# EAGLE design LPC1115_4TE_TOP V1.1 (EAGLE 7.6.0)
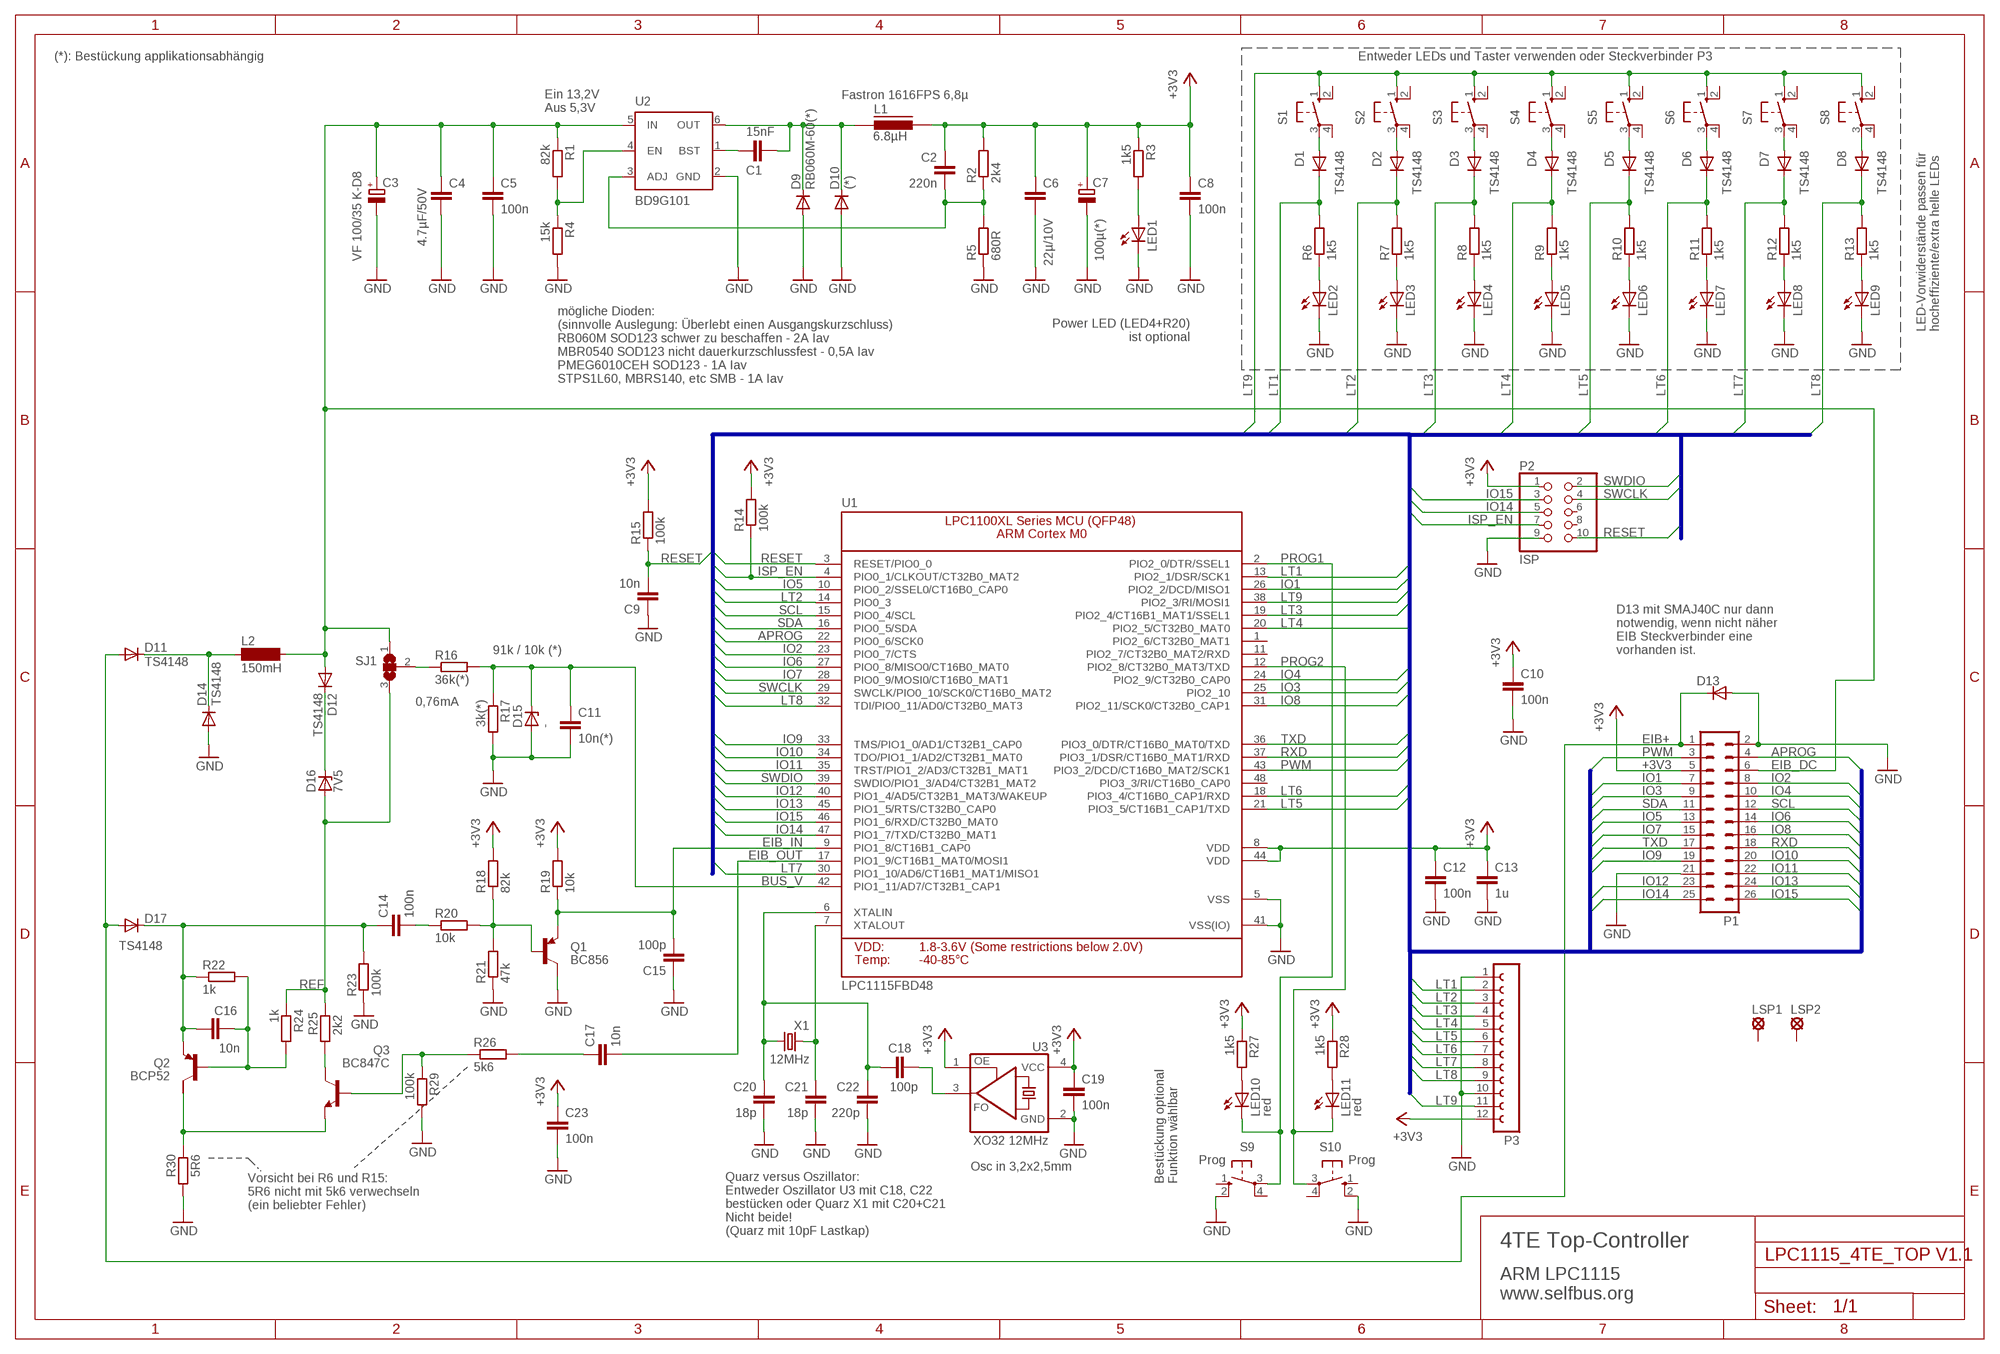
[diagram p0: schematic, sheet 1]

## Parts
C1  15nF  C-EUC0805M  [R0805M]
C2  220n  C-EUC0805M  [R0805M]
C3  VF 100/35 K-D8  CPOL-EUESMD-D  [ESMD-D]
C4  4.7µF/50V  C-EUC1206M  [R1206M]
C5  100n  C-EUC0805M  [R0805M]
C6  22µ/10V  C-EUC1210K  [C1210K]
C7  100µ(*)  CPOL-EUESMD-D  [ESMD-D]
C8  100n  C-EUC0805M  [R0805M]
C9  10n  C-EUC0805M  [R0805M]
C10  100n  C-EUC0805M  [R0805M]
C11  10n(*)  C-EUC0805M  [R0805M]
C12  100n  C-EUC0805M  [R0805M]
C13  1u  C-EUC0805M  [R0805M]
C14  100n  C-EUC0805M  [R0805M]
C15  100p  C-EUC0805M  [R0805M]
C16  10n  C-EUC0805M  [R0805M]
C17  10n  C-EUC0805M  [R0805M]
C18  100p  C-EUC0805M  [R0805M]
C19  100n  C-EUC0805M  [R0805M]
C20  18p  C-EUC0805M  [R0805M]
C21  18p  C-EUC0805M  [R0805M]
C22  220p  C-EUC0805M  [R0805M]
C23  100n  C-EUC0805M  [R0805M]
D1  TS4148  DIODE-D0805  [D0805]
D2  TS4148  DIODE-D0805  [D0805]
D3  TS4148  DIODE-D0805  [D0805]
D4  TS4148  DIODE-D0805  [D0805]
D5  TS4148  DIODE-D0805  [D0805]
D6  TS4148  DIODE-D0805  [D0805]
D7  TS4148  DIODE-D0805  [D0805]
D8  TS4148  DIODE-D0805  [D0805]
D9  RB060M-60(*)  DIODE-SOD123  [SOD123]
D10  (*)  DIODE-SMB  [SMB]
D11  TS4148  DIODE-D0805  [D0805]
D12  TS4148  DIODE-D0805  [D0805]
D13  D-SMB  [SMB]
D14  TS4148  DIODE-D0805  [D0805]
D15  -  ZENER-DIODESOT23  [SOT23]
D16  7V5  ZENER-DIODESOT23  [SOT23]
D17  TS4148  DIODE-D0805  [D0805]
L1  6.8µH  IND_FASTRON_1616FPSB  [1616FPS]
L2  150mH  SD12BS11_LIEGEND  [BS11_LIEGEND]
LED1  LEDSMT1206  [1206]
LED2  LEDSMT1206  [1206]
LED3  LEDSMT1206  [1206]
LED4  LEDSMT1206  [1206]
LED5  LEDSMT1206  [1206]
LED6  LEDSMT1206  [1206]
LED7  LEDSMT1206  [1206]
LED8  LEDSMT1206  [1206]
LED9  LEDSMT1206  [1206]
LED10  red  LEDSMT1206  [1206]
LED11  red  LEDSMT1206  [1206]
LSP1  SE13_SM  [SE13_SM]
LSP2  SE13_SM  [SE13_SM]
P1  ML26  [ML26]
P2  ISP  PINHD-2X05_2.00  [2X05M]
P3  FE12-1  [FE12]
Q1  BC856  BC856BSMD  [SOT23-BEC]
Q2  BCP52  FZT753SMD  [SOT223]
Q3  BC847C  BC847  [SOT23]
R1  82k  R-EU_R0805M  [R0805M]
R2  2k4  R-EU_R0805M  [R0805M]
R3  1k5  R-EU_R0805M  [R0805M]
R4  15k  R-EU_R0805M  [R0805M]
R5  680R  R-EU_R0805M  [R0805M]
R6  1k5  R-EU_R0805M  [R0805M]
R7  1k5  R-EU_R0805M  [R0805M]
R8  1k5  R-EU_R0805M  [R0805M]
R9  1k5  R-EU_R0805M  [R0805M]
R10  1k5  R-EU_R0805M  [R0805M]
R11  1k5  R-EU_R0805M  [R0805M]
R12  1k5  R-EU_R0805M  [R0805M]
R13  1k5  R-EU_R0805M  [R0805M]
R14  100k  R-EU_R0805M  [R0805M]
R15  100k  R-EU_R0805M  [R0805M]
R16  36k(*)  R-EU_R0805M  [R0805M]
R17  3k(*)  R-EU_R0805M  [R0805M]
R18  82k  R-EU_R0805M  [R0805M]
R19  10k  R-EU_R0805M  [R0805M]
R20  10k  R-EU_R0805M  [R0805M]
R21  47k  R-EU_R0805M  [R0805M]
R22  1k  R-EU_R0805M  [R0805M]
R23  100k  R-EU_R0805M  [R0805M]
R24  1k  R-EU_R0805M  [R0805M]
R25  2k2  R-EU_R0805M  [R0805M]
R26  5k6  R-EU_R0805M  [R0805M]
R27  1k5  R-EU_R0805M  [R0805M]
R28  1k5  R-EU_R0805M  [R0805M]
R29  100k  R-EU_R0805M  [R0805M]
R30  5R6  R-EU_R1206M  [R1206M]
S1  10-XXSMD  [B3F-10XX_SMD]
S2  10-XXSMD  [B3F-10XX_SMD]
S3  10-XXSMD  [B3F-10XX_SMD]
S4  10-XXSMD  [B3F-10XX_SMD]
S5  10-XXSMD  [B3F-10XX_SMD]
S6  10-XXSMD  [B3F-10XX_SMD]
S7  10-XXSMD  [B3F-10XX_SMD]
S8  10-XXSMD  [B3F-10XX_SMD]
S9  Prog  10-XXSMD  [B3F-10XX_SMD]
S10  Prog  10-XXSMD  [B3F-10XX_SMD]
SJ1  SJ2W  [SJ_2]
U1  LPC1115FBD48  LPC1113/4/5_QFP48_XLSERIES  [LQFP48]
U2  BD9G101  BD9G101GBD9G101G-SOT23-6MOD  [SOT23-6MOD]
U3  XO32 12MHz  ASFL  [ASF]
X1  12MHz  CRYSTALASF  [ASF]

## Nets
+3V3: C2.1 C6.1 C7.+ C8.1 C10.1 C12.1 C13.1 C19.1 C23.1 L1.P$2 P1.5 P2.1 P3.12 R2.2 R3.1 R14.2 R15.2 R18.2 R19.2 R27.1 R28.1 U1.8(VDD) U1.44(VDD) U3.1(OE) U3.4(VCC)
APROG: P1.4 U1.22(PIO0_6/SCK0)
BUS_V: C11.1 D15.3(C) R16.2 R17.1 U1.42(PIO1_11/AD7/CT32B1_CAP1)
DRAIN: C14.1 C16.1 D17.C Q2.3(E) R22.1 R23.2
EIB+: D11.A D13.1(C) D17.A P1.1
EIB_DC: C3.+ C4.1 C5.1 D12.A L2.2 P1.6 R1.1 SJ1.1 U2.5(IN)
EIB_IN: C15.2 Q1.E R19.1 U1.9(PIO1_8/CT16B1_CAP0)
EIB_OUT: C17.2 U1.17(PIO1_9/CT16B1_MAT0/MOSI1)
GND: C3.- C4.2 C5.2 C6.2 C7.- C8.2 C9.1 C10.2 C11.2 C12.2 C13.2 C15.1 C19.2 C20.2 C21.2 C22.2 C23.2 D9.A D10.A D13.2(A) D14.A D15.1(A) LED1.C LED2.C LED3.C LED4.C LED5.C LED6.C LED7.C LED8.C LED9.C P1.2 P1.21 P2.9 P3.1 P3.10 Q1.C R4.2 R5.1 R17.2 R21.1 R23.1 R29.2 R30.1 S9.2(S1) S10.2(S1) U1.5(VSS) U1.41(VSS(IO)) U2.2(GND) U3.2(GND)
IO1: P1.7 U1.26(PIO2_2/DCD/MISO1)
IO2: P1.8 U1.23(PIO0_7/CTS)
IO3: P1.9 U1.25(PIO2_10)
IO4: P1.10 U1.24(PIO2_9/CT32B0_CAP0)
IO5: P1.13 U1.10(PIO0_2/SSEL0/CT16B0_CAP0)
IO6: P1.14 U1.27(PIO0_8/MISO0/CT16B0_MAT0)
IO7: P1.15 U1.28(PIO0_9/MOSI0/CT16B0_MAT1)
IO8: P1.16 U1.31(PIO2_11/SCK0/CT32B0_CAP1)
IO9: P1.19 U1.33(TMS/PIO1_0/AD1/CT32B1_CAP0)
IO10: P1.20 U1.34(TDO/PIO1_1/AD2/CT32B1_MAT0)
IO11: P1.22 U1.35(TRST/PIO1_2/AD3/CT32B1_MAT1)
IO12: P1.23 U1.40(PIO1_4/AD5/CT32B1_MAT3/WAKEUP)
IO13: P1.24 U1.45(PIO1_5/RTS/CT32B0_CAP0)
IO14: P1.25 P2.5 U1.47(PIO1_7/TXD/CT32B0_MAT1)
IO15: P1.26 P2.3 U1.46(PIO1_6/RXD/CT32B0_MAT0)
ISP_EN: P2.7 R14.1 U1.4(PIO0_1/CLKOUT/CT32B0_MAT2)
LT1: D1.C P3.2 R6.2 U1.13(PIO2_1/DSR/SCK1)
LT2: D2.C P3.3 R7.2 U1.14(PIO0_3)
LT3: D3.C P3.4 R8.2 U1.19(PIO2_4/CT16B1_MAT1/SSEL1)
LT4: D4.C P3.5 R9.2 U1.20(PIO2_5/CT32B0_MAT0)
LT5: D5.C P3.6 R10.2 U1.21(PIO3_5/CT16B1_CAP1/TXD)
LT6: D6.C P3.7 R11.2 U1.18(PIO3_4/CT16B0_CAP1/RXD)
LT7: D7.C P3.8 R12.2 U1.30(PIO1_10/AD6/CT16B1_MAT1/MISO1)
LT8: D8.C P3.9 R13.2 U1.32(TDI/PIO0_11/AD0/CT32B0_MAT3)
LT9: P3.11 S1.1(S) S2.1(S) S3.1(S) S4.1(S) S5.1(S) S6.1(S) S7.1(S) S8.1(S) U1.38(PIO2_3/RI/MOSI1)
LX: C1.1 D9.C D10.C L1.P$1 U2.6(OUT)
N$1: C17.1 R26.2
N$2: C14.2 R20.1
N$3: C21.1 U1.7(XTALOUT) X1.1
N$4: LED11.A R28.2
N$5: R16.1 SJ1.2
N$6: Q3.3(C) R25.1
N$7: Q2.2(C) Q3.2(E) R30.2
N$8: D11.C D14.C L2.1
N$9: D12.C D16.3(C)
N$12: Q3.1(B) R26.1 R29.1
N$13: LED1.A R3.2
N$14: Q1.B R18.1 R20.2 R21.2
N$15: C16.2 Q2.1(B) R22.2 R24.2
N$16: C18.1 U3.3(FO)
N$17: D8.A S8.3(P)
N$19: C1.2 U2.1(BST)
N$20: R1.2 R4.1 U2.4(EN)
N$22: C18.2 C20.1 C22.1 U1.6(XTALIN) X1.3
N$23: D7.A S7.3(P)
N$24: C2.2 R2.1 R5.2 U2.3(ADJ)
N$25: LED2.A R6.1
N$28: D6.A S6.3(P)
N$29: D5.A S5.3(P)
N$30: D4.A S4.3(P)
N$31: D3.A S3.3(P)
N$32: D2.A S2.3(P)
N$33: LED3.A R7.1
N$34: D1.A S1.3(P)
N$35: LED10.A R27.2
N$48: LED4.A R8.1
N$50: LED5.A R9.1
N$51: LED6.A R10.1
N$53: LED7.A R11.1
N$55: LED8.A R12.1
N$57: LED9.A R13.1
PROG1: LED10.C S9.3(P) U1.2(PIO2_0/DTR/SSEL1)
PROG2: LED11.C S10.3(P) U1.12(PIO2_8/CT32B0_MAT3/TXD)
PWM: P1.3 U1.43(PIO3_2/DCD/CT16B0_MAT2/SCK1)
REF: D16.1(A) R24.1 R25.2 SJ1.3
RESET: C9.2 P2.10 R15.1 U1.3(RESET/PIO0_0)
RXD: P1.18 U1.37(PIO3_1/DSR/CT16B0_MAT1/RXD)
SCL: P1.12 U1.15(PIO0_4/SCL)
SDA: P1.11 U1.16(PIO0_5/SDA)
SWCLK: P2.4 U1.29(SWCLK/PIO0_10/SCK0/CT16B0_MAT2)
SWDIO: P2.2 U1.39(SWDIO/PIO1_3/AD4/CT32B1_MAT2)
TXD: P1.17 U1.36(PIO3_0/DTR/CT16B0_MAT0/TXD)
Unconnected: LSP1.MP LSP2.MP P2.6 P2.8 Q2.4(C/) S1.2(S1) S1.4(P1) S2.2(S1) S2.4(P1) S3.2(S1) S3.4(P1) S4.2(S1) S4.4(P1) S5.2(S1) S5.4(P1) S6.2(S1) S6.4(P1) S7.2(S1) S7.4(P1) S8.2(S1) S8.4(P1) S9.1(S) S9.4(P1) S10.1(S) S10.4(P1) U1.1(PIO2_6/CT32B0_MAT1) U1.11(PIO2_7/CT32B0_MAT2/RXD) U1.48(PIO3_3/RI/CT16B0_CAP0)

## Buses
IO[1..15],LT[1..9],SCL,SDA,PWM,APROG,RXD,TXD,RESET,SWCLK,SWDIO,ISP_EN

## Notes on the sheet
- (*): Bestückung applikationsabhängig | Entweder LEDs und Taster verwenden oder Steckverbinder P3
- Fastron 1616FPS 6,8µ
- Ein 13,2V
  Aus 5,3V
- Power LED (LED4+R20)
  ist optional
- LED-Vorwiderstände passen für 
  hocheffiziente/extra helle LEDs
- mögliche Dioden:
  (sinnvolle Auslegung: Überlebt einen Ausgangskurzschluss)
  RB060M SOD123 schwer zu beschaffen - 2A Iav
  MBR0540 SOD123 nicht dauerkurzschlussfest - 0,5A Iav
  PMEG6010CEH SOD123 - 1A Iav
  STPS1L60, MBRS140, etc SMB - 1A Iav
- 91k / 10k (*)
- D13 mit SMAJ40C nur dann
  notwendig, wenn nicht näher
  EIB Steckverbinder eine
  vorhanden ist.
- 0,76mA
- Osc in 3,2x2,5mm
- Bestückung optional
  Funktion wählbar
- Vorsicht bei R6 und R15:
  5R6 nicht mit 5k6 verwechseln
  (ein beliebter Fehler)
- Quarz versus Oszillator:
  Entweder Oszillator U3 mit C18, C22
  bestücken oder Quarz X1 mit C20+C21
  Nicht beide!
  (Quarz mit 10pF Lastkap)
- 4TE Top-Controller
- ARM LPC1115
  www.selfbus.org

## Library data of the parts
C1 C2 C4-C6 C8-C23 = rcl:C-EU: CAPACITOR, European symbol
C3 C7 = rcl:CPOL-EU: POLARIZED CAPACITOR, European symbol
D1-D12 D14 D17 = diode:DIODE-: DIODE
D13 = semicon-smd-ipc:D-: DIODE unfilled
D15 D16 = diode:ZENER-DIODE: Z-Diode
L1 = Stefan_selfbus:IND_FASTRON_1616FPS
L2 = inductor-neosid:SD12: INDUCTOR nominal inductance
LED1-LED11 = led:LED: LED OSRAM: - CHIPLED LG R971, LG N971, LY N971, LG Q971, LY Q971, LO R971, LY R971 LH N974, LH R974 LS Q976, LO Q976, LY Q976 LO Q996 - Hyper CHIPLED LW Q18S LB Q993, LB Q99A, LB R99A - SideLED LS A670, LO A670, LY A670, LG A670, LP A670 LB A673, LV A673, LT A673, LW A673 LH A674 LY A675 LS A676, LA A676, LO A676, LY A676, LW A676 LS A679, LY A679, LG A679 - Hyper Micro SIDELED® LS Y876, LA Y876, LO Y876, LY Y876 LT Y87S - SmartLED LW L88C, LW L88S LB L89C, LB L89S, LG L890 LS L89K, LO L89K, LY L89K LS L896, LA L896, LO L896, LY L896 - TOPLED LS T670, LO T670, LY T670, LG T670, LP T670 LSG T670, LSP T670, LSY T670, LOP T670, LYG T670 LG T671, LOG T671, LSG T671 LB T673, LV T673, LT T673, LW T673 LH T674 LS T676, LA T676, LO T676, LY T676, LB T676, LH T676, LSB T676, LW T676 LB T67C, LV T67C, LT T67C, LS T67K, LO T67K, LY T67K, LW E67C LS E67B, LA E67B, LO E67B, LY E67B, LB E67C, LV E67C, LT E67C LW T67C LS T679, LY T679, LG T679 LS T770, LO T770, LY T770, LG T770, LP T770 LB T773, LV T773, LT T773, LW T773 LH T774 LS E675, LA E675, LY E675, LS T675 LS T776, LA T776, LO T776, LY T776, LB T776 LHGB T686 LT T68C, LB T68C - Hyper Mini TOPLED® LB M676 - Mini TOPLED Santana® LG M470 LS M47K, LO M47K, LY M47K Source: http://www.osram.convergy.de - LUMILED® LXK2-PW12-R00, LXK2-PW12-S00, LXK2-PW14-U00, LXK2-PW14-V00 LXK2-PM12-R00, LXK2-PM12-S00, LXK2-PM14-U00 LXK2-PE12-Q00, LXK2-PE12-R00, LXK2-PE12-S00, LXK2-PE14-T00, LXK2-PE14-U00 LXK2-PB12-K00, LXK2-PB12-L00, LXK2-PB12-M00, LXK2-PB14-N00, LXK2-PB14-P00, LXK2-PB14-Q00 LXK2-PR12-L00, LXK2-PR12-M00, LXK2-PR14-Q00, LXK2-PR14-R00 LXK2-PD12-Q00, LXK2-PD12-R00, LXK2-PD12-S00 LXK2-PH12-R00, LXK2-PH12-S00 LXK2-PL12-P00, LXK2-PL12-Q00, LXK2-PL12-R00 Source: www.luxeon.com
LSP1 LSP2 = solpad:SE13: SOLDER PAD E1542, drill 1,3mm, distributor Buerklin, 07F815
P1 = con-harting-ml:ML26: HARTING; OC_FARNELL: unknown; OC_NEWARK: unknown
P2 = pinhead-2:PINHD-2X05: PIN HEADER
P3 = con-lsta:FE12-1: FEMALE HEADER; OC_FARNELL: unknown; OC_NEWARK: unknown
Q1 = transistor-pnp:BC856*: PNP Transistror
Q2 = transistor-pnp:FZT753SMD: PNP Transistor
Q3 = transistor:BC847: NPN TRANSISTOR
R1-R30 = rcl:R-EU_: RESISTOR, European symbol
S1-S10 = switch-omron:10-XX: OMRON SWITCH
SJ1 = jumper:SJ2W: SMD solder JUMPER
U1 = microbuilder:LPC1113/4/5_QFP48_XLSERIES: LPC1113/4/5 ARM Cortex M0 MCU (50MHz) - XL Series (FBD48/3x3) LPC1115FBD48/303: Max Frequency: 50MHz Flash: 64kB SRAM: 8kB ADC: 10-bit
U2 = Stefan_selfbus:BD9G101G
U3 = crystal:ASF*: CRYSTAL CLOCK OSCILLATORS 5.0 Vdc or 3.3 Vdc - LOW PROFILE ULTRA MINIATURE CERAMIC SURFACE MOUNT Source: http://www.abracon.com/Oscillators/asf1-L-L1.pdf
X1 = crystal:CRYSTAL: CRYSTAL

## Board
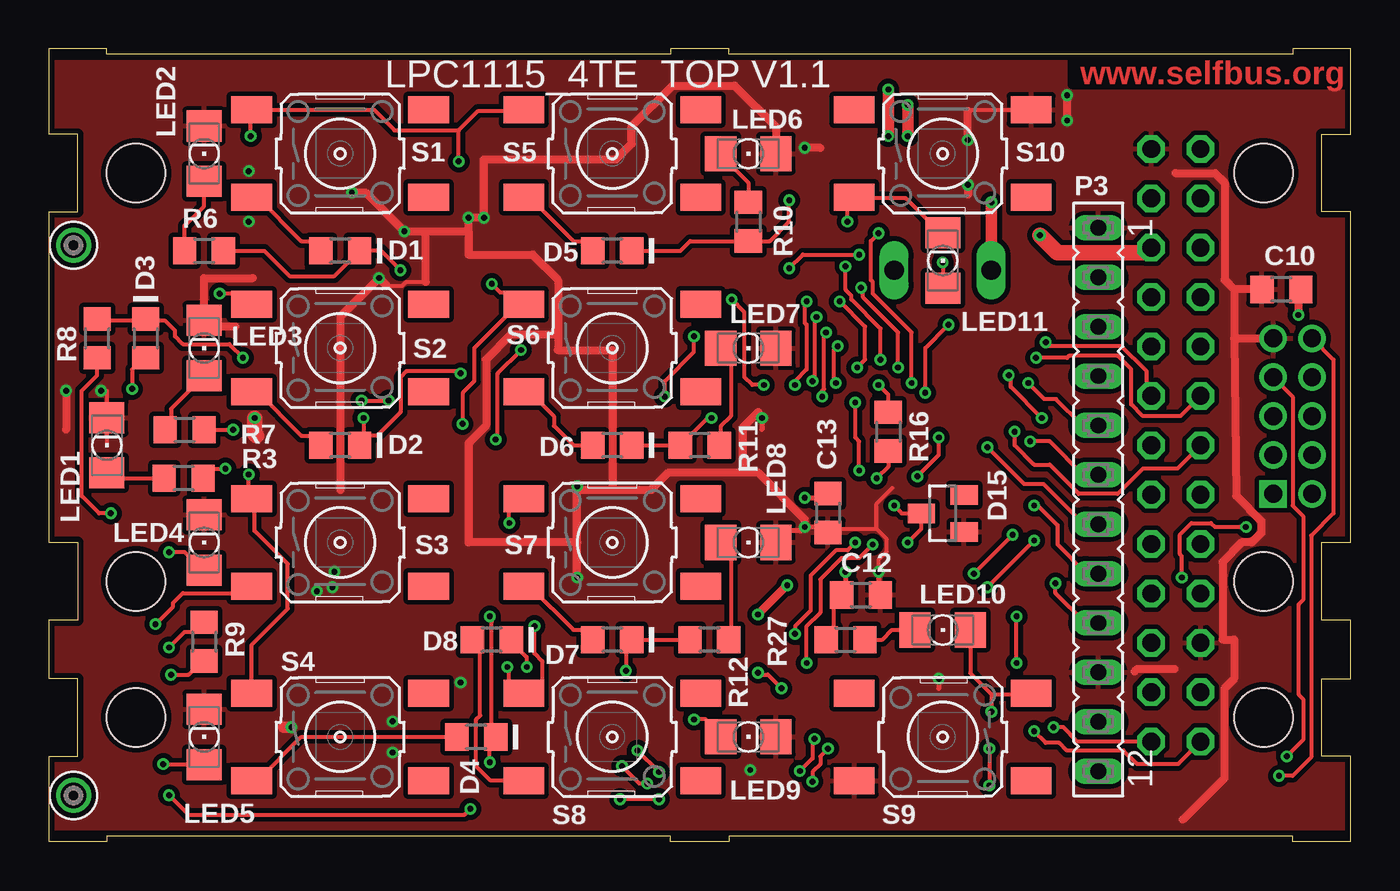
[diagram p1: board, top side]
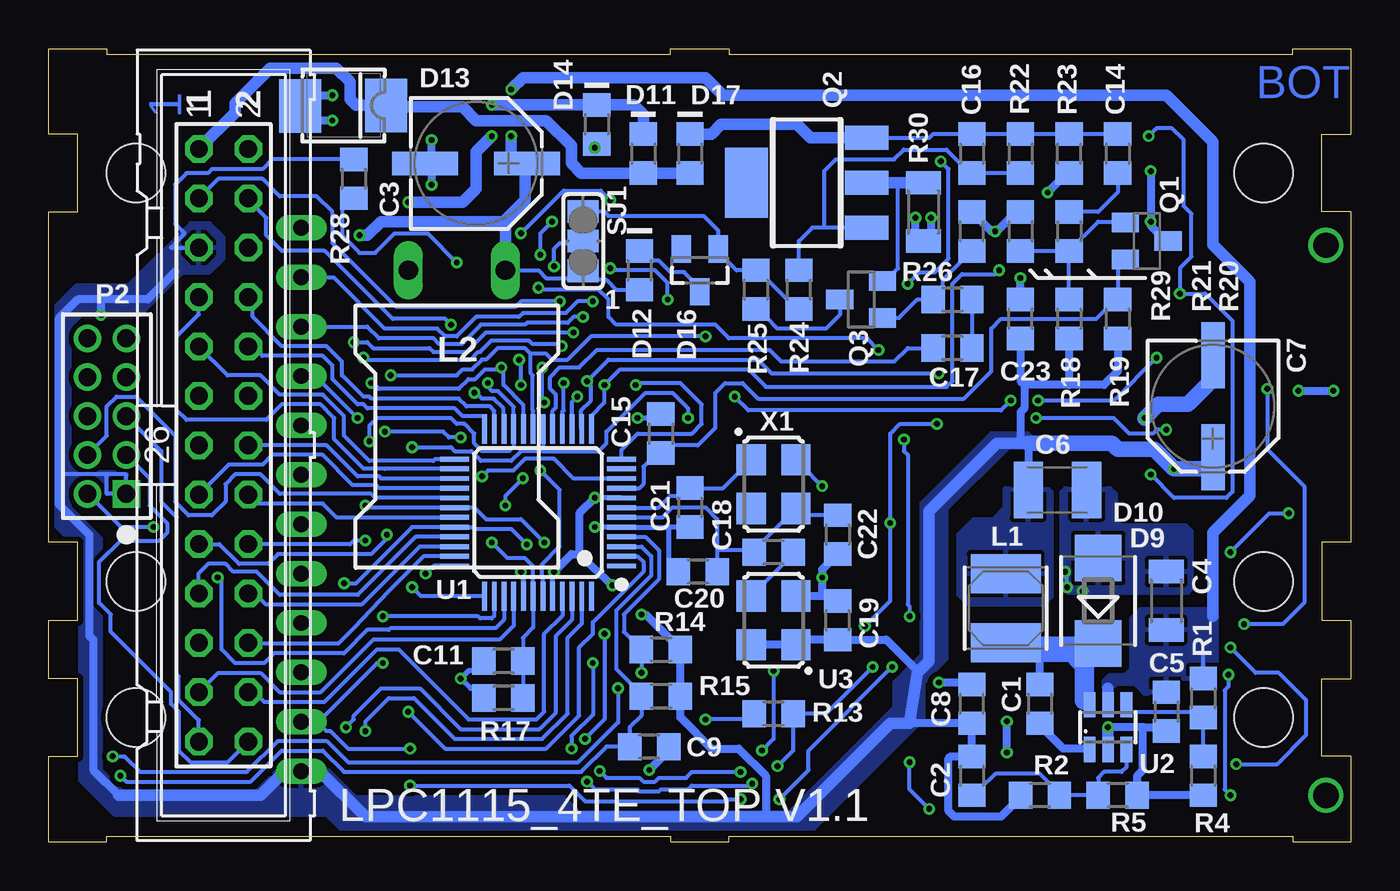
[diagram p2: board, bottom side, seen from below]

Size 67 x 40.8 mm. Coordinates in mm from the lower left corner, seen from the top.
Outline: 67,0 67,4.4 65.5,4.4 65.5,8.4 67,8.4 67,11.4 65.5,11.4 65.5,15.4 67,15.4 67,32.4 65.5,32.4 65.5,36.4 67,36.4 67,40.8 64,40.8 64,40.5 35,40.5 35,40.8 32,40.8 32,40.5 3,40.5 3,40.8 0,40.8 0,36.4 1.5,36.4 1.5,32.4 0,32.4 0,15.4 1.5,15.4 1.5,11.4 0,11.4 0,8.4 1.5,8.4 1.5,4.4 0,4.4 0,0 3,0 3,0.3 32,0.3 32,0 35,0 35,0.3 64,0.3 64,0 67,0
Copper layers (1*16): Top 0.035mm / dielectric 1.5mm / Bottom 0.035mm
Design rules "default *": minimum track width 0.18mm, minimum drill 0.3mm, track to track 0.18mm, track to pad 0.18mm, pad to pad 0.18mm, via to via 0.18mm, smd to smd 0.18mm, copper to edge 0.3mm, drill to drill 0.3mm, minimum pad ring 0.25mm, minimum via ring 0.15mm, stop-mask expansion 0.075mm, vias tented up to drill 12mil, thermal gap 0.2mm
Holes 3 mm at 62.5,6.4 4.5,6.4 4.5,34.4 62.5,34.4 4.5,13.4 62.5,13.4
bRestrict: area 23.6,16.3 to 24,16.5

### Footprints (pad centres in the part's own frame; a part is rotated, then mirrored left to right if it is on the bottom)
R0805M = smd 1.2 x 1.4: 1 -1,0; 2 1,0
ESMD-D = smd 1.2 x 3.4: + 0,2.623; - 0,-2.623
R1206M = smd 1.2 x 1.8: 1 -1.5,0; 2 1.5,0
C1210K = smd 1.5 x 2.9: 1 -1.5,0; 2 1.5,0
D0805 = smd 1.2 x 1.4: A 1,0; C -1,0
SOD123 = smd 1.4 x 1.4: A 1.9,0; C -1.9,0
SMB = smd 2.4 x 2.4: A 2.2,0; C -2.2,0
SMB' = smd 2.159 x 2.743: 1 -2.311,-0.127; 2 2.108,-0.102
SOT23 = smd 1 x 1.4: 1 -0.95,-1.1; 2 0.95,-1.1; 3 0,1.1
1616FPS = smd 3.6 x 2: P$1 0,1.775; P$2 0,-1.775
BS11_LIEGEND = drill 1 long: 1 -2.5,0; 2 2.5,0
1206 = smd 1.6 x 1.803: A -1.422,0; C 1.422,0
SE13_SM = drill 1.3: MP 0,0
ML26 = drill 0.914 octagon: 1 -15.24,-1.27; 2 -15.24,1.27; 3 -12.7,-1.27; 4 -12.7,1.27; 5 -10.16,-1.27; 6 -10.16,1.27; 7 -7.62,-1.27; 8 -7.62,1.27; 9 -5.08,-1.27; 10 -5.08,1.27; 11 -2.54,-1.27; 12 -2.54,1.27; 13 0,-1.27; 14 0,1.27; 15 2.54,-1.27; 16 2.54,1.27; 17 5.08,-1.27; 18 5.08,1.27; 19 7.62,-1.27; 20 7.62,1.27; 21 10.16,-1.27; 22 10.16,1.27; 23 12.7,-1.27; 24 12.7,1.27; 25 15.24,-1.27; 26 15.24,1.27
2X05M = drill 0.914 square: 1 -4,-1 | drill 0.914: 2 -4,1; 3 -2,-1; 4 -2,1; 5 0,-1; 6 0,1; 7 2,-1; 8 2,1; 9 4,-1; 10 4,1
FE12 = drill 0.813 long: 1 -13.97,0; 2 -11.43,0; 3 -8.89,0; 4 -6.35,0; 5 -3.81,0; 6 -1.27,0; 7 1.27,0; 8 3.81,0; 9 6.35,0; 10 8.89,0; 11 11.43,0; 12 13.97,0
SOT23-BEC = smd 1 x 1.4: B -0.95,-1.1; C 0,1.1; E 0.95,-1.1
SOT223 = smd 1.219 x 2.235: 1 -2.311,-3.099; 2 0,-3.099; 3 2.311,-3.099 | smd 3.6 x 2.2: 4 0,3.099
B3F-10XX_SMD = smd 2.1 x 1.4: 1 -4.55,2.25; 2 4.55,2.25; 3 -4.55,-2.25; 4 4.55,-2.25
SJ_2 = smd 1.168 x 1.6: 1 -1.524,0; 2 0,0; 3 1.524,0
LQFP48 = smd 1.5 x 0.25: 1 -4.3,2.75; 2 -4.3,2.25; 3 -4.3,1.75; 4 -4.3,1.25; 5 -4.3,0.75; 6 -4.3,0.25; 7 -4.3,-0.25; 8 -4.3,-0.75; 9 -4.3,-1.25; 10 -4.3,-1.75; 11 -4.3,-2.25; 12 -4.3,-2.75; 25 4.3,-2.75; 26 4.3,-2.25; 27 4.3,-1.75; 28 4.3,-1.25; 29 4.3,-0.75; 30 4.3,-0.25; 31 4.3,0.25; 32 4.3,0.75; 33 4.3,1.25; 34 4.3,1.75; 35 4.3,2.25; 36 4.3,2.75 | smd 0.25 x 1.5: 13 -2.75,-4.3; 14 -2.25,-4.3; 15 -1.75,-4.3; 16 -1.25,-4.3; 17 -0.75,-4.3; 18 -0.25,-4.3; 19 0.25,-4.3; 20 0.75,-4.3; 21 1.25,-4.3; 22 1.75,-4.3; 23 2.25,-4.3; 24 2.75,-4.3; 37 2.75,4.3; 38 2.25,4.3; 39 1.75,4.3; 40 1.25,4.3; 41 0.75,4.3; 42 0.25,4.3; 43 -0.25,4.3; 44 -0.75,4.3; 45 -1.25,4.3; 46 -1.75,4.3; 47 -2.25,4.3; 48 -2.75,4.3
SOT23-6MOD = smd 0.6 x 1.3: 1 -0.95,-1.15; 2 0,-1.15; 3 0.95,-1.15; 4 0.95,1.15; 5 0,1.15; 6 -0.95,1.15
ASF = smd 1.6 x 1.5: 1 -1.25,-1.15; 2 1.25,-1.15; 3 1.25,1.15; 4 -1.25,1.15

### Placement (x,y rotation side)
C1  16,7.1 270 bottom
C2  19.5,3.4 270 bottom
C3  45,34.9 270 bottom
C4  9.5,12.4 90 bottom
C5  9.5,6.7 270 bottom
C6  15.1,18.1 0 bottom
C7  7.1,22.4 180 bottom
C8  19.5,7.1 90 bottom
C9  36.1,4.9 180 bottom
C10  63.42,28.42 180 top
C11  43.6,9.3 180 bottom
C12  41.8,12.7 0 top
C13  40.1,16.92 270 top
C14  12,35.4 270 bottom
C15  35.5,21 270 bottom
C16  19.5,35.4 270 bottom
C17  20.5,25.4 180 bottom
C18  29.7,14.9 180 bottom
C19  26.4,11.4 90 bottom
C20  33.6,13.9 180 bottom
C21  34,17.2 270 bottom
C22  26.4,15.8 270 bottom
C23  17,26.9 90 bottom
D1  15,30.4 180 top
D2  15,20.4 180 top
D3  5,25.9 270 top
D4  22,5.4 180 top
D5  29,30.4 180 top
D6  29,20.4 180 top
D7  29,10.4 180 top
D8  22.8,10.4 180 top
D9  13,12.4 90 bottom
D10  13,12.4 90 bottom
D11  36.4,35.4 270 bottom
D12  36.6,29.4 270 bottom
D13  [SMB']  51.95,37.75 180 bottom
D14  38.8,36.9 270 bottom
D15  46,16.9 90 top
D16  33.5,29.4 180 bottom
D17  34,35.4 270 bottom
L1  17.76,12.03 180 bottom
L2  46,29.4 0 bottom
LED1  3,20.4 90 top
LED2  8,35.4 90 top
LED3  8,25.4 90 top
LED4  8,15.4 90 top
LED5  8,5.4 90 top
LED6  36,35.4 0 top
LED7  36,25.4 0 top
LED8  36,15.4 0 top
LED9  36,5.4 0 top
LED10  46,10.9 0 top
LED11  46,29.9 90 top
LSP1  1.28,30.69 0 top
LSP2  1.28,2.39 0 top
P1  58,20.4 270 bottom
P2  64,21.9 90 bottom
P3  54,17.61 270 top
Q1  10.5,30.9 270 bottom
Q2  28,33.9 90 bottom
Q3  25.2,27.9 90 bottom
R1  7.6,7.4 270 bottom
R2  16,2.4 180 bottom
R3  6.95,18.7 180 top
R4  7.6,3.4 270 bottom
R5  12,2.4 180 bottom
R6  8,30.4 0 top
R7  7,21.2 0 top
R8  2.5,25.9 90 top
R9  8,10.3 270 top
R10  36,31.9 270 top
R11  33.5,20.4 180 top
R12  34,10.4 180 top
R13  29.7,6.6 0 bottom
R14  35.5,9.9 0 bottom
R15  35.5,7.5 0 bottom
R16  43.2,21.1 270 top
R17  43.6,7.4 180 bottom
R18  14.5,26.9 270 bottom
R19  12,26.9 270 bottom
R20  14.5,31.4 270 bottom
R21  17,31.4 270 bottom
R22  17,35.4 270 bottom
R23  14.5,35.4 90 bottom
R24  28.4,28.4 90 bottom
R25  30.6,28.4 90 bottom
R26  20.5,27.9 0 bottom
R27  41,10.4 0 top
R28  51.3,34.1 270 bottom
R29  19.5,31.4 90 bottom
R30  22,32.4 90 bottom
S1  15,35.4 0 top
S2  15,25.4 0 top
S3  15,15.4 0 top
S4  15,5.4 0 top
S5  29,35.4 0 top
S6  29,25.4 0 top
S7  29,15.4 0 top
S8  29,5.4 0 top
S9  46,5.4 180 top
S10  46,35.4 0 top
SJ1  39.5,30.9 90 bottom
U1  41.82,16.94 180 bottom
U2  12.5,5.9 0 bottom
U3  29.7,11.4 90 bottom
X1  29.7,18.4 270 bottom

### Tracks (layer width: path | path; a pad name or v marks a point on that pad's centre or on a via)
+3V3  (via drill 0.3)
  Top 0.2: R27.1 40.4,10.83 40.4,12.3 C12.1 | R3.1 8.4,18.3 8.4,19.2 v9.1,19.2
  Top 0.25: v38.9,17.7 40.08,17.7 C13.1 | v41,13.9 41,12.9 C12.1
  Top 0.4: C10.1 64.3,28.42 v64.3,27.1 | v38,13.2 v36.5,11.7
  Bottom 0.2: 64,18.9 66.5,18.9 | R28.1 55.5,35.1 56,34.6 58.6,34.6 58.8,34.4 59.9,34.4 60.5,33.8 60.5,31.79 60,31.3 60.7,30.56 P1.5 | 64,18.9 64,17.9 P2.1 63,18.9 64,18.9
  Bottom 0.25: U1.8 v38.89,17.69 v38.9,17.7 | U1.44 41.07,13.83 v41,13.9
  Bottom 0.4: 14.5,23.5 16.8,23.5 | R18.2 14.5,23.5 | C23.1 17,23.7 16.8,23.5 | 16.8,23.5 16.8,22.3 17,22.1 17,20.5 | 16.6,20.5 C6.1 | 60.5,29.33 61.9,27.9 64.3,27.9 | 64.3,27.9 65.5,27.9 66.5,26.9 66.5,18.9 66.5,17.4 64.9,15.8 64.9,10.6 64.7,10.4 64.7,3.7 63.4,2.4 | v38.9,17.7 39.7,16.9 39.7,14.8 | 39.7,14.8 v38,13.2 | v41,13.9 40.1,14.8 39.7,14.8 | v64.3,27.1 64.3,27.9 | R19.2 12,24.2 12.7,23.5 14.5,23.5 | 30.1,1.3 30.1,3.4 31.5,4.8 32.9,4.8 34.5,6.4 R15.2 R14.2 36.3,11.7 v36.5,11.7 | R2.2 17,2.3 18,1.3 20.4,1.3 20.7,1.6 20.7,4.3 20.6,4.4 C2.1 C8.1 22.7,6.1 | U3.4 U3.1 28.3,10.4 C19.1 23.9,10.4 22.25,8.75
  Bottom 0.6: 54.01,3.7 53.1,3.7 50.7,1.3 30.1,1.3 28.5,1.3 23.7,6.1 22.7,6.1 22.3,8.7 22.25,8.75 21.7,9.3 21.7,17 18.2,20.5 17,20.5 16.6,20.5 | 54.81,3.69 56.1,2.4 63.4,2.4
  Bottom 0.8: 16.6,20.5 12.3,20.5 12,20.2 10.1,20.2 v9.1,19.2 7.4,19.2 7.1,19.5 C7.+
  pour Bottom: 15.4,12.6 15.8,12.2 19.7,12.2 20.2,12.7 20.2,15.8 19.4,16.6 18.4,16.6 17.8,17.2 17.8,18.2 15.6,18.2 15.4,18
  pour Bottom (isolate 0.25): 16.4,20.3 16.3,20.4 16.3,20.7 16.6,21 18.5,21 22.1,17.4 22.1,9.6 23.5,8.2 23.5,6.9 28.9,1.5 39.7,1.5 40.5,2.3 51.2,2.3 52.8,3.9 55,3.9 56.3,2.6 63.2,2.6 64.3,3.7 64.3,15.6 65.9,17.2 65.9,18.2 65.6,18.5 64.5,18.5 63.9,17.9 63.2,17.9 63,18.1 63,18.8 63.2,19 65.2,19 65.9,19.7 65.9,26.5 65.3,27.1 62.3,27.1 60.1,29.3 58.7,29.3 58,30 58,31.1 58.7,31.8 59.7,31.8 62.9,28.6 65.6,28.6 66.9,27.3 66.9,16.5 65.4,15 65.4,3.2 63.6,1.4 52.7,1.4 52,0.7 27.6,0.7 22,6.3 22,8.2 20.8,9.4 20.8,17.1 17.6,20.3
APROG  (via drill 0.3)
  Top 0.2: v45.1,23.1 45.1,25.4 v46.3,26.6
  Bottom 0.2: v46.3,26.6 46.6,26.9 49.3,26.9 52.8,30.4 55,30.4 55.8,31.2 55.8,32.1 56.73,33.03 P1.4 | v45.1,23.1 45,23.1 44.7,22.8 44.1,22.8 43.6,22.3 43.6,22 43.57,21.97 U1.22
BUS_V  (via drill 0.3)
  Top 0.2: R16.2 43.2,19.3 v42.6,18.7 | v43.5,17.3 43.9,16.9 D15.3 44.9,16.1 v44.2,15.4
  Bottom 0.2: v44.2,15.4 43.4,14.6 42.5,14.6 42.07,14.17 U1.42 42.07,11.03 42.6,10.5 C11.1 R17.1 | v43.5,17.3 43.5,17.8 v42.6,18.7
DRAIN
  Bottom 0.2: C14.1 R23.2 R22.1 C16.1 21.5,36.4 21.69,36.21 Q2.3
  Bottom 0.6: D17.C 32.9,36.4 32.4,36.9 28.5,36.9 27.81,36.21 Q2.3
EIB+
  Bottom 0.6: P1.1 57.4,37.51 57.4,38 55.6,39.8 52.2,39.8 51.5,39.1 51.5,38.2 51.18,37.88 D13.1 49.56,37.8 45.7,37.8 45,37.1 41.4,37.1 40.1,35.8 40.1,34.9 39.6,34.4 D11.A D17.A
EIB_DC  (via drill 0.3)
  Top 0.6: v43.2,36.3 v43.2,38.7
  Top 0.8: P1.6 56.47,30.3 51.9,30.3 v51,31.2
  Bottom 0.2: L2.2 41.8,29.4 41.4,29 39.88,29 SJ1.1 39.5,29.4 39,28.9 38.3,28.9 37.8,28.4 D12.A | R1.1 7.6,9.6
  Bottom 0.6: L2.2 43.5,31.9 | 43.5,31.9 43.5,32 42.5,33 42.5,34.75 C3.+ 42.6,34.9 42.5,35 43.2,35 v43.2,36.3 | 7.1,11.6 7.1,15.9 5.2,17.8 5.2,28.8 7.1,30.7 7.1,36 9.5,38.4 32.3,38.4 33.2,39.3 42.6,39.3 v43.2,38.7 | v51,31.2 50.6,31.2 49.9,31.9 43.5,31.9 | U2.5 12.5,7.9
  pour Bottom: 12.7,7.6 12.7,8.3 12.4,8.6 11.6,8.6 11.3,8.9 11.3,11.5 10.8,12 7.2,12 6.9,11.7 6.9,9.1 7,9 7,8.6 7.3,8.3 8.7,8.3 9.5,7.6 10.6,7.6 11.1,8.1 12.1,8.1 12.3,7.9 12.3,7.6
EIB_IN
  Bottom 0.2: U1.9 36.61,18.19 36.4,18.4 36.4,19.3 35.6,20.1 | Q1.E 12,29.55 R19.1 12.1,27.9 13.1,26.9 18,26.9 18.5,26.4 18.5,24.2 19.9,22.8 30.5,22.8 31.3,23.6 32.2,23.6 32.7,23.1 32.7,21.3 33.6,20.4 35.3,20.4 35.6,20.1 | C15.2 35.6,20.1
EIB_OUT
  Bottom 0.2: U1.17 41.07,22.18 40.9,22.35 40.9,23 41.2,23.3 41.2,23.9 40.7,24.4 39.7,24.4 38.8,25.3 29.9,25.3 29.3,24.7 23.5,24.7 22.8,25.4 C17.2
GND  (via drill 0.3)
  Top 0.2: 17.4,28.6 18.2,28.6 18.4,28.8 19.4,28.8 | 8.32,26.5 LED3.C 7.98,26.8 | C13.2 40.42,15.92 40.6,16.1 42.6,16.1 | v42.7,13.9 42.7,14.5 43.1,14.9 43.1,15.6 42.6,16.1 | 42.6,16.1 42.6,17.4 43.4,18.2 | 47.3,37.6 47.35,37.65 S10.2 | 3,20.4 LED1.C 3,23.2 v2.7,23.2 | 27.2,18.1 v27.2,18.3
  Top 0.25: LED8.C 37.42,15.42 38,16 38.7,16 v38.9,16.2 39.62,16.2 C13.2 | v42.7,13.9 42.7,12.8 C12.2 | v45.8,8.4 45.8,7.9 | v36.7,21.8 36.7,21.2
  Top 0.4: v27.2,13.6 27.2,15.4 | 27.2,15.4 27.2,18.1 29,18.1 | 57.97,34.4 60,34.4 60.5,33.9 60.5,28.9 61,28.4 | 61,28.4 61,28.42 C10.2 | 61,28.4 61,25.9 | 61,25.9 P2.9 | 61,25.9 61.1,17.8 62.4,16.5 62.4,15.9 61.9,15.4 61.4,15.4 60.4,14.4 60.4,10.4 61,10.4 61,8.4 60.5,7.9 60.5,3.3 58.35,1.15 | P1.21 59.43,10.4 | 19.4,31.4 v18.3,31.4 16.3,33.4 v15.6,33.4 | 19.4,31.4 21.6,31.4 | 21.6,31.4 v21.6,32.1 v22.4,32.1 22.4,35.1 29.2,35.1 30,35.9 30,36.8 32.1,38.9 35.3,38.9 37.42,36.78 LED6.C | v10.3,31.9 10.2,31.9 | LED3.C 8,29 10.5,29 | LED2.C 8.08,36.82 | 21.6,31.4 21.6,30.2 24.9,30.2 26.2,28.9 26.2,26.1 | 26.2,26.1 23.8,26.1 22.5,24.8 22.5,21.4 21.6,20.5 21.6,15.4 27.2,15.4 | 26.2,26.1 26.2,25.3 29,25.3 29,18.1 | 29,18.1 31,18.1 31.9,19 35.7,19 | 35.7,19 36.5,19 38.9,16.6 v38.9,16.2 | 36.5,22.1 35.7,21.3 35.7,19 | 15,18.1 15,27 v17,29 17.4,28.6 | 19.4,28.8 19.4,31.4 | 9.6,26.5 8.32,26.5 | 55.87,8.77 56,8.9 57.93,8.9 | 39.7,35.7 v38.9,35.7 | v47.3,36.1 47.3,37.6 | v47.3,33.8 47.3,33.3 | v52.4,38.4 v52.4,37.1 | v0.9,23.2 0.9,21.2
  Top 0.6: v12.5,5.9 12.1,5.9
  Top 0.8: v10.6,21.8 10.6,21 10.7,20.9
  Bottom 0.2: v14.6,13.1 14.6,13.8 v14.7,13.9 | v27.2,18.3 28.2,19.3 | v38.9,35.7 39.2,35.7 D14.A
  Bottom 0.25: v38.9,16.2 v38.89,16.19 U1.5 35.11,16.19 35.1,16.2 | 35.1,16.2 C21.2 | U1.41 42.57,13.77 v42.7,13.9 | C11.2 44.6,9.2 45,8.8 45.4,8.8 v45.8,8.4 45.3,7.9 45.1,7.9 R17.2 | C15.1 35.7,21.8 v36.7,21.8 | 35.1,16.2 35.1,14.4 C20.2
  Bottom 0.4: R21.1 17.2,32.4 18.2,31.4 v18.3,31.4 18.5,31.4 R29.2 | v22.4,32.1 22.4,30.9 R30.1 21.6,30.9 v21.6,32.1 | R23.1 14.6,34.4 v15.6,33.4 | 9.3,30.9 Q1.C 9.5,30.9 10.3,31.7 v10.3,31.9 v10.3,34.5 | C23.2 v17,29 | C3.- 47.3,34.95 | 47.3,34.95 v47.3,36.1 | 47.3,34.95 v47.3,33.8 | D13.2 54.06,38.46 54.1,38.4 v52.4,38.4 | v52.4,37.1 53.9,37.1 54,37 54,37.7 54.1,37.8 | C9.1 34.9,4.9 v36.1,3.7 | R4.2 R5.1 11,3.4 10.7,3.7 10.7,5.9 | 10.7,5.9 v12.5,5.9 | C8.2 19.5,8.2 v21.2,8.2 | v2.7,23.2 v0.9,23.2 | 10.7,5.9 9.5,5.9 C5.2 | v17.7,4.6 v17.7,6.2 | U3.2 27.1,12.65 | 27.1,12.65 26.65,12.65 C19.2 | 27.1,12.65 27.2,12.75 v27.2,13.6 27.2,14 C22.2
  Bottom 0.6: U2.2 v12.5,5.9
  Bottom 0.8: C7.- 7.1,23.8 8.4,22.5 9.9,22.5 v10.6,21.8
  other vias: 13.8,12.9
  pour Top (isolate 0.25): 66.9,40.1 0.1,40.1 0.1,0.7 66.9,0.7
  pour Bottom: 8.4,12.8 14.5,12.8 14.9,13.2 14.9,18 14.7,18.2 12.4,18.2 12.1,17.9 12.1,16.6 11.8,16.3 8.5,16.3 8.2,16 8.2,13
IO1
  Bottom 0.2: U1.26 49.69,19.19 49.7,19.2 50.8,19.2 52.3,20.7 52.3,21.8 53,22.5 55,22.5 55.8,21.7 59.9,21.7 60.4,22.2 60.4,26 59.27,27.13 P1.7
IO2
  Bottom 0.2: U1.23 44.07,22.17 44.3,22.4 45.5,22.4 45.9,22.8 50.4,22.8 50.5,22.9 50.8,22.9 51.9,24 51.9,24.7 52.7,25.5 55,25.5 56.5,27 56.5,27.5 56.73,27.73 P1.8
IO3
  Bottom 0.2: P1.9 57.79,24 56.1,24 55.1,23 52.9,23 51.8,21.9 51.8,20.9 50.5,19.6 47.2,19.6 47.11,19.69 U1.25
IO4
  Bottom 0.2: 56.75,25.5 P1.10 56.48,25.48 56,25 52.9,25 52.4,24.5 52.4,23.8 51.1,22.5 50.8,22.5 50.6,22.3 46.1,22.3 45.7,21.9 44.6,21.9 44.6,21.27 U1.24
IO5  (via drill 0.3)
  Top 0.2: P1.13 58.07,19.2 56.3,19.2 55,17.9 53,17.9 51.5,19.4 50.7,19.4 49.7,20.4 v49.7,21.1 | v44.7,18.8 45.8,19.9 v45.8,20.8
  Bottom 0.2: U1.10 39.99,18.69 41,19.7 42.5,19.7 43.1,19.1 44.4,19.1 v44.7,18.8 | v45.8,20.8 46.4,20.8 46.7,21.1 v49.7,21.1
IO6
  Bottom 0.2: P1.14 52.7,20.4 51.1,18.8 50,18.8 49.9,18.7 U1.27
IO7
  Bottom 0.2: U1.28 49.99,18.19 50.15,18.35 51.35,18.35 52.9,19.9 55.5,19.9 56,19.4 57.73,19.4 P1.15
IO8
  Bottom 0.2: P1.16 56.27,17.4 52.9,17.4 52.2,16.7 U1.31
IO9
  Bottom 0.2: U1.33 48.11,15.69 51.1,12.7 55.1,12.7 56.3,13.9 57.5,13.9 57.9,14.3 58.8,14.3 59.27,13.83 P1.19
IO10
  Bottom 0.2: U1.34 47.91,15.19 50.9,12.2 55.8,12.2 56.4,12.8 56.71,12.8 P1.20
IO11
  Bottom 0.2: U1.35 47.71,14.69 49.5,12.9 51.3,11 52.1,10.2 56.29,10.2 P1.22
IO12
  Bottom 0.2: U1.40 43.07,11.13 43.8,10.4 50.3,10.4 53,7.7 55.1,7.7 56.1,8.7 58.27,8.7 P1.23
IO13
  Bottom 0.2: P1.24 56.4,7.7 55.9,7.2 52.8,7.2 50.1,9.9 49,9.9 45.4,6.3 41.9,6.3 41.5,6.7 41.5,10.7 40.57,11.63 U1.45
IO14  (via drill 0.3)
  Top 0.2: v50.7,5.7 51.3,5.1 52,5.1 52.4,4.7 55.3,4.7 56,4 58.1,4 59.3,5.2 59.3,5.19 P1.25
  Bottom 0.2: P2.5 61.2,20.1 61.2,17.5 60.4,16.7 60.4,8.6 60.3,8.5 60.3,7.3 59.27,6.27 P1.25 | v50.7,5.7 50.7,6.2 49.5,7.4 48.2,7.4 46.1,5.3 41.6,5.3 40.3,6.6 40.3,10.5 39.57,11.23 U1.47
IO15  (via drill 0.3)
  Top 0.2: P1.26 52.94,5.16 52.2,5.9 v51.7,5.9
  Bottom 0.2: P2.3 61.8,18.7 61.8,17.3 60.9,16.4 60.9,15.9 61.3,15.5 63.3,15.5 64.4,14.4 64.4,12.3 63.8,11.7 63.8,10.8 60.7,7.7 60.7,7.1 60.3,6.7 60.3,4.7 59.7,4.1 57.79,4.1 P1.26 | v51.7,5.9 51.3,6.3 51.3,6.5 49.9,7.9 47.9,7.9 45.8,5.8 41.75,5.8 40.9,6.65 40.9,10.6 40.07,11.43 U1.46
ISP_EN  (via drill 0.3)
  Top 0.2: P2.7 64,22.9 64,17.3 64.55,16.75 64.55,12.45 64.3,12.2 64.3,7.6 64.55,7.35 64.55,5.25 v63.7,4.4 | v36.5,8.7 36.6,8.6 37,8.6 v37.7,7.9
  Bottom 0.2: v63.7,4.4 63.1,4.4 62.3,3.6 56.8,3.6 55.2,5.2 52.7,5.2 51.6,4.1 39.75,4.1 37.7,6.15 v37.7,7.9 | U1.4 36.29,15.69 35.6,15 35.6,13.5 37.4,11.7 37.4,10.8 R14.1 v36.5,8.7
LT1  (via drill 0.3)
  Top 0.2: v18.1,29.4 17.1,30.4 D1.C 14.7,29.1 12.4,29.1 11.1,30.4 R6.2 | v39,27.8 39,27.6 38.9,27.5 38.9,26.7 39,26.6 39,24.3 38.4,23.7 v38.4,23.5
  Bottom 0.2: v18.1,29.4 18.3,29.2 20,29.2 20.5,28.7 20.5,23.7 20.8,23.4 30.1,23.4 31,24.3 37.6,24.3 v38.4,23.5 38.4,22.6 39.07,21.93 U1.13 | v39,27.8 39.8,27.8 40.4,27.2 42.6,27.2 42.8,27 45,27 46,26 46.6,26 47,26.4 49.7,26.4 52.34,29.04 P3.2
LT2  (via drill 0.3)
  Top 0.2: R7.2 v9.5,21.2 | v16.2,21.8 16.2,20.9 16.4,20.9 | v39.5,27 39.4,26.9 39.4,23.8 v39.3,23.7 | v21.2,24.1 21.2,24.2 18.4,24.2 18.1,23.9 18.1,22.1 16.9,20.9 16.4,20.9 | 16.4,20.9 16.4,20.8 D2.C
  Bottom 0.2: U1.14 39.6,21.27 39.6,22.2 39.1,22.7 39.1,23.5 v39.3,23.7 | 39.3,23.5 v39.3,23.7 | v39.5,27 40,27 40.3,26.7 42.4,26.7 42.5,26.6 44.75,26.6 45.75,25.6 46.9,25.6 47.2,25.9 50,25.9 50.6,26.5 P3.3 | v39.3,23.7 38.2,24.8 30.5,24.8 29.8,24.1 v21.2,24.1 | v9.5,21.2 10,21.2 10.2,21 11.4,21 12.2,21.8 v16.2,21.8
LT3  (via drill 0.3)
  Top 0.2: v10,24.9 9.3,25.6 6.9,25.6 6.5,26 6.5,26.3 6,26.8 5,26.8 | v16.1,22.7 v17.5,22.7 | v51.1,21.8 49.5,23.4 49.5,23.9 v49.4,24 | v31.7,22.9 31.7,23.7 33.2,25.2 v33.2,26 | 5,26.8 2.6,26.8 R8.2 | D3.C 5,26.8
  Bottom 0.2: U1.19 42.07,22.17 42.1,22.2 42.1,24 42.2,24.1 42.2,25.1 | v10,24.9 12.2,22.7 v16.1,22.7 | v49.4,24 46,24 45.7,24.3 45.2,24.3 44.7,24.8 44.5,24.8 43.9,25.4 42.5,25.4 42.2,25.1 | v17.5,22.7 18,22.2 31,22.2 v31.7,22.9 | v33.2,26 39.1,26 40.3,24.8 41.1,24.8 41.4,25.1 42.2,25.1 | P3.4 53.26,23.96 v51.1,21.8
LT4  (via drill 0.3)
  Top 0.2: v22.7,11.6 22.7,11.4 22.8,11.3 22.8,5.5 D4.C 22.7,5.1 v22.7,4.1 | v50.4,23.6 51.23,22.77 51.83,22.77 53.18,21.42 P3.5 | v23,20.7 23.1,20.8 23.1,24.1 v24.3,25.3 | v43.7,24.4 43.7,26.2 41.9,28 41.9,28.4 v41.8,28.5 | v6.2,2.4 7.2,1.4 21.4,1.4 v21.7,1.7 | v6.3,8.6 7.2,8.6 7.6,9 7.7,9 R9.2
  Bottom 0.2: v50.4,23.6 50.3,23.6 50,23.3 45.9,23.3 45.4,23.8 45.05,23.8 44.55,24.3 43.8,24.3 43.6,24.1 | v24.3,25.3 24.9,25.9 32,25.9 32.7,26.6 37.8,26.6 38.2,27 38.2,27.9 38.7,28.4 41.7,28.4 v41.8,28.5 | U1.20 42.57,22.47 43.6,23.5 43.6,24.1 | 43.6,24.1 v43.7,24.4 | v6.3,8.6 6.3,8 6.5,7.8 6.5,2.7 v6.2,2.4 | v21.7,1.7 22.7,2.7 v22.7,4.1 | v23,20.7 23,20.1 22.8,19.9 22.8,12.2 22.7,12.1 v22.7,11.6
LT5  (via drill 0.3)
  Top 0.2: D5.C 32.5,30.4 33,30.9 R10.2 37.1,30.9 38.1,31.9 v38.1,33 | v50.5,20.6 51.5,20.6 53.22,18.88 P3.6 | v44.4,23.6 44.4,26.2 42.4,28.2 42.4,28.8 42.3,28.9 42.3,30.9 v42.7,31.3
  Bottom 0.2: v44.4,23.6 44.4,23.4 44.2,23.2 43.9,23.2 43.07,22.37 U1.21 43.07,20.33 43.3,20.1 44.7,20.1 45.1,20.5 45.1,21 45.6,21.5 46,21.5 46.3,21.8 50.1,21.8 50.5,21.4 v50.5,20.6 | v42.7,31.3 40.5,33.5 38.6,33.5 v38.1,33
LT6  (via drill 0.3)
  Top 0.2: D6.C R11.2 33.9,21.8 v34.1,21.8 | v48.3,20.3 50.2,18.4 51.2,18.4 53.26,16.34 P3.7
  Bottom 0.2: U1.18 41.57,20.1 | 41.57,20.1 38.7,20.1 38.3,20.5 38.3,21.1 36.3,23.1 34.9,23.1 34.1,22.3 v34.1,21.8 | 41.57,20.1 42.7,20.1 43.2,19.6 44.75,19.6 45.25,20.1 46.1,20.1 46.3,20.3 v48.3,20.3
LT7  (via drill 0.3)
  Top 0.2: R12.2 D7.C 29.7,10.1 v29.7,8.8 | v50.7,17.3 50.9,17.3 51.9,16.3 51.9,15.3 53.4,13.8 P3.8 | v41.5,15.4 41.1,15 40.5,15 39.2,13.7 39.2,11.9 38.4,11.1 v38.4,10.7 | v39.4,5.3 39.3,5.2 39.3,4.3 v38.65,3.65 | v31.4,3.6 v30.3,4.7
  Bottom 0.2: U1.30 50.6,17.2 v50.7,17.3 | U1.30 | U1.30 45.1,17.2 44.5,16.6 42.7,16.6 v41.5,15.4 | v29.7,8.8 29.7,5.3 v30.3,4.7 | v38.4,10.7 38.4,6.3 v39.4,5.3 | v38.65,3.65 38.3,3.3 36.6,3.3 36.4,3.1 35.8,3.1 35.6,3.3 34.2,3.3 33.9,3.6 v31.4,3.6
LT8  (via drill 0.3)
  Top 0.2: v51.8,13.3 51.8,12.8 53.34,11.26 P3.9 | v42.4,15.3 41.7,14.6 40.8,14.6 39.7,13.5 39.7,11.8 39,11.1 v39,9.2 | v40.1,4.8 39.7,4.4 39.7,4 39.3,3.6 v39.3,3.1 | v30.8,3 30.4,3 v29.5,3.9 | D8.C 23.8,10.3 24.6,9.5 v24.6,9
  Bottom 0.2: v51.8,13.3 51.19,13.3 48.3,16.19 U1.32 45.19,16.19 45.1,16.1 43.2,16.1 v42.4,15.3 | v24.6,9 27,6.6 R13.2 28.7,4.7 v29.5,3.9 | v39,9.2 39,6.55 40.1,5.45 v40.1,4.8 | v39.3,3.1 38.9,2.7 36.7,2.7 36.6,2.6 35.6,2.6 35.5,2.7 34.1,2.7 33.9,2.9 30.9,2.9 v30.8,3
LT9  (via drill 0.3)
  Top 0.2: 21.1,36.6 17.8,36.6 16.75,37.65 S1.1 10.45,37.15 10.4,37.1 v10.4,36.3 | 21.1,36.6 22.1,37.6 24.4,37.6 S5.1 | S2.1 10.05,27.65 9.5,28.2 v8.8,28.2 | v10.3,18.9 10.3,17.9 S3.1 10.6,17.5 10.6,16 12.3,14.3 12.3,12 10.45,10.15 S4.1 | v22.8,28.7 23.25,28.25 23.45,28.25 24,27.7 S6.1 24.15,27.65 21.9,25.4 21.9,23.7 21.3,23.1 v21.3,21.5 | v21.1,35 21.1,36.6 | v23.6,9 23.7,8.9 23.7,8 24.05,7.65 S8.1 24.5,7.7 25.4,7.7 25.4,9.3 25,9.7 v25,11.1 | v23.7,16.4 23.7,17.2 23.9,17.4 24.2,17.4 S7.1 | v49.8,9.2 v49.8,11.6 | v48.4,4.8 v48.4,2.9 | v31.4,2.2 v29.4,2.2
  Bottom 0.2: v10.4,36.3 10,36.7 9.2,36.7 8.6,36.1 8.6,32.7 8.2,32.3 8.2,30.1 8.8,29.5 v8.8,28.2 7.5,28.2 6.1,26.8 6.1,18 6.4,17.7 9.1,17.7 v10.3,18.9 | v22.8,28.7 22.2,29.3 21.4,29.3 20.7,30 20.7,34.6 v21.1,35 | U1.38 44.07,11.63 44.2,11.5 44.8,11.5 44.9,11.6 v49.8,11.6 | v25,11.1 23.7,12.4 v23.7,16.4 23.7,21 23.2,21.5 v21.3,21.5 | v48.4,4.8 51.6,4.8 52.5,5.7 52.7,5.7 53,6 53,6.06 53.12,6.18 | v48.4,2.9 40.2,2.9 39.4,2.1 32.2,2.1 32.1,2.2 v31.4,2.2 | v23.6,9 27.9,4.7 27.9,3.7 v29.4,2.2 | P3.11 53.12,6.18 | 53.12,6.18 50.1,9.2 v49.8,9.2
LX
  Bottom 0.4: C1.1 16,9.9
  Bottom 0.6: U2.6 13.7,7.3
  Bottom 1: 13.7,7.3 13.7,9.1 14.5,9.9
  Bottom 1.3: L1.P$1 17.16,9.9 16,9.9 14.5,9.9 13.3,9.9 D10.C D9.C
N$1
  Bottom 0.2: R26.2 C17.1
N$2
  Bottom 0.2: C14.2 12,33.4 13,32.4 R20.1
N$3
  Bottom 0.2: U1.7 35.61,17.19 35,17.8 34.4,17.8 C21.1 32.3,18.2 X1.1
N$4  (via drill 0.3)
  Top 0.2: v46,29.8 LED11.A
  Bottom 0.2: v46,29.8 47.5,31.3 49.2,31.3 50.2,30.3 51,30.3 51.9,31.2 51.9,32.9 51.6,33.2 R28.2
N$5  (via drill 0.3)
  Top 0.2: R16.1 43.2,23 v42.7,23.5 | v42.8,24.8 42.8,26.4 41.3,27.9 41.3,28.1 41,28.4 v41,29.6
  Bottom 0.2: v42.7,23.5 42.7,24.7 v42.8,24.8 | v41,29.6 41,30.5 40.7,30.8 39.6,30.8 SJ1.2
N$6
  Bottom 0.2: Q3.3 26.3,27.1 27,26.4 29.5,26.4 30.1,27 30.2,27 R25.1
N$7
  Bottom 0.2: Q3.2 24.5,28.9 23.9,28.9 23.3,29.5 23.3,33.9 | 23.9,33.9 Q2.2
  Bottom 0.6: R30.2 23.3,33.9 23.9,33.9
N$8  (via drill 0.3)
  Top 0.6: L2.1 v48.5,32.9 | v44.2,36.3 v44.2,37.9
  Bottom 0.6: D11.C 36.4,37.4 36.9,37.9 D14.C v44.2,37.9 | v48.5,32.9 45.7,32.9 45,33.6 45,35.5 v44.2,36.3
N$9
  Bottom 0.2: D16.3 33.5,28.5 34.3,29.3 35,29.3 35.6,29.9 36,29.9 36.5,30.4 D12.C
N$12
  Bottom 0.2: Q3.1 23.25,26.95 22.3,27.9 R26.1 21,28.4 21,28.9 R29.1
N$13
  Top 0.2: LED1.A 3.28,18.7 R3.2
N$14
  Bottom 0.2: R21.2 R20.2 | R18.1 R20.2 | R20.2 13,31.9 11.65,31.9 Q1.B
N$15
  Bottom 0.2: R24.2 28.4,30.9 27.71,31.59 27.1,31.59 | Q2.1 27.1,31.59 | C16.2 19.7,34.4 | 27.1,31.59 27.1,34.5 26.5,35.1 23.5,35.1 23,35.6 20.8,35.6 20,34.8 19.9,34.8 C16.2 | R22.2 C16.2
N$16
  Bottom 0.2: C18.1 28.7,14.8 U3.3
N$17
  Top 0.2: S8.3 22.75,3.15 22,3.9 22,6.3 22.2,6.5 22.2,9.9 22,10.1 D8.A
N$19
  Bottom 0.4: 13.5,4.8 14.8,4.8 15.7,5.7 15.8,5.7 C1.2
  Bottom 0.6: U2.1 13.5,4.8
N$20
  Bottom 0.2: R4.1 R1.2 7.9,6.7 11.6,6.7 11.6,7 U2.4
N$22
  Bottom 0.2: 32.6,15 32.6,16.6 33.2,17.2 34.9,17.2 35.41,16.69 U1.6 | 32.6,15 C20.1 | 32.6,15 30.7,15 C18.2 30.5,15.1 30.5,15.2 X1.3 28.2,16.8 C22.1
N$23
  Top 0.2: S7.3 24.75,13.15 27,10.9 27.6,10.9 D7.A
N$24
  Bottom 0.2: U2.3 11.55,3.85 11.8,3.6 12.7,3.6 13,3.3 R5.2 R2.1 15,2.5 16,3.5 18.3,3.5 19.1,2.7 19.2,2.7 C2.2
N$25
  Top 0.2: R6.1 7,31.7 8,32.7 LED2.A
N$28
  Top 0.2: S6.3 24.75,23.15 26,21.9 26,21.4 27,20.4 D6.A
N$29
  Top 0.2: S5.3 24.75,33.15 27,30.9 27.5,30.9 D5.A
N$30
  Top 0.2: S4.3 10.75,3.15 13,5.4 D4.A
N$31  (via drill 0.3)
  Top 0.2: S3.3 9.85,13.15 9.5,12.8 6.9,12.8 6.4,12.3 6.4,12.1 v5.5,11.2 | D3.A 4.7,24.7 4.3,24.3 v4.3,23.3
  Bottom 0.2: v4.3,23.3 4.3,20.2 2.4,18.3 2.4,12.3 3.5,11.2 v5.5,11.2
N$32
  Top 0.2: S2.3 10.75,23.15 13,20.9 13.5,20.9 D2.A
N$33
  Top 0.2: LED3.A 6.3,22.28 6.3,21.2 R7.1
N$34
  Top 0.2: S1.3 10.75,33.15 13,30.9 13.5,30.9 D1.A
N$35
  Top 0.2: R27.2 42.9,10.4 43.4,10.9 LED10.A
N$48  (via drill 0.3)
  Top 0.2: R8.1 2.5,24 1.7,23.2 1.7,17.8 2.6,16.9 v3.2,16.9 | LED4.A 7.42,13.98 7.4,14.5 7,14.9 v6.2,14.9
  Bottom 0.2: v6.2,14.9 4.2,16.9 v3.2,16.9
N$50  (via drill 0.3)
  Top 0.2: v6.2,10 7,10.8 7.4,10.8 7.6,11 7.7,11 R9.1 | LED5.A 6.02,3.98 v5.9,4
  Bottom 0.2: v5.9,4 3.8,4 2.3,5.5 2.3,7.3 3.7,8.7 4.9,8.7 v6.2,10
N$51
  Top 0.2: LED6.A 34.58,35.32 36,33.9 R10.1
N$53
  Top 0.2: LED7.A 34.58,25.32 35.1,24.8 35.1,21.9 34.6,21.4 34.6,20.4 R11.1
N$55
  Top 0.2: LED8.A 34.58,15.32 35.1,14.8 35.1,10.9 35,10.8 R12.1
N$57  (via drill 0.3)
  Top 0.2: LED9.A 34.6,5.5 33.8,6.3 v33.2,6.3
  Bottom 0.2: R13.1 31,6.3 v33.2,6.3
PROG1  (via drill 0.3)
  Top 0.2: LED10.C 47.42,8.68 48.5,7.6 | 48.5,7.6 50.5,7.6 S9.3 | 48.5,7.6 v48.5,6.7
  Bottom 0.2: U1.2 36.69,14.69 36.4,14.4 36.4,13.9 39,11.3 39,10.7 39.7,10 39.7,6.5 41.4,4.8 46.6,4.8 v48.5,6.7
PROG2  (via drill 0.3)
  Top 0.2: LED11.C 45.88,31.32 44.1,33.1 41.5,33.1 S10.3 41.15,33.15 41.1,33.1 v41.1,31.9 | v36.8,23.5 36.2,23.5 35.8,23.9 35.8,27.25 v35.15,27.9 | v38.1,29.5 38.8,30.2 v41.7,30.2
  Bottom 0.2: U1.12 37.52,20.18 36.7,21 33.9,21 33.4,21.5 33.4,22.5 34.5,23.6 36.6,23.6 36.7,23.5 v36.8,23.5 | v41.7,30.2 41.7,31.3 v41.1,31.9 | v35.15,27.9 35.15,28.75 35.8,29.4 38,29.4 v38.1,29.5
PWM  (via drill 0.3)
  Top 0.2: v41.7,19.1 41.7,20.6 41.5,20.8 v41.5,22.6 | v41.6,24.4 42,24.8 42,26.5 v40.7,27.8
  Bottom 0.2: U1.43 41.55,13.55 41.6,13.6 41.6,14.28 41.62,14.28 40.7,15.2 40.7,18.1 v41.7,19.1 | v41.5,22.6 41.6,22.6 v41.6,24.4 | P1.3 58.27,34.1 56,34.1 55.1,33.2 53.2,33.2 52.4,32.4 52.4,30.8 49.1,27.5 43,27.5 42.7,27.8 v40.7,27.8
REF
  Bottom 0.2: SJ1.3 39.48,32.4 38.4,32.4 38.2,32.2 33.3,32.2 32.55,31.45 D16.1 32.5,30.45 32.5,30.3 31.6,29.4 R25.2 30.5,29.4 28.5,27.4 R24.1
RESET  (via drill 0.3)
  Top 0.2: P2.10 66.1,24.8 66.1,16.9 64.95,15.75 64.95,4.35 64,3.4 v63.3,3.4
  Bottom 0.2: v63.3,3.4 63,3.1 56.6,3.1 55,4.7 52.9,4.7 51.8,3.6 39.6,3.6 38.3,4.9 C9.2 37.1,5.9 36.5,6.5 R15.1 36.6,7.6 36.6,7.7 37.8,8.9 37.8,11.9 36,13.7 36,14.7 36.49,15.19 U1.3
RXD  (via drill 0.3)
  Top 0.2: v48.3,13.1 v50.7,15.5
  Bottom 0.2: v48.3,13.1 47.84,12.64 U1.37 | v50.7,15.5 51.3,15.5 51.5,15.3 55.5,15.3 55.52,15.32 P1.18
SCL  (via drill 0.3)
  Top 0.2: P1.12 56.5,23.17 56.5,24.2 55.2,25.5 51.5,25.5 v51.3,25.7 | v39.8,22.9 39.8,23.2 39.9,23.3 39.9,26.1 v40,26.2
  Bottom 0.2: v51.3,25.7 50.6,25.7 50.3,25.4 47.4,25.4 47.2,25.2 45.5,25.2 44.5,26.2 v40,26.2 | U1.15 40.07,22.63 v39.8,22.9
SDA  (via drill 0.3)
  Top 0.2: P1.11 58.23,21.9 56.3,21.9 55.7,22.5 55.7,24.3 55,25 52.5,25 52.4,24.9 v50.8,24.9 | v40.5,23.6 40.4,23.7 40.4,25.3 v40.6,25.5
  Bottom 0.2: v50.8,24.9 50.7,24.8 45.3,24.8 44.9,25.2 44.8,25.2 44.2,25.8 42.3,25.8 42.1,25.6 40.7,25.6 v40.6,25.5 | U1.16 40.57,22.13 40.5,22.2 v40.5,23.6
SWCLK
  Bottom 0.2: U1.29 50.19,17.69 50.4,17.9 55.1,17.9 56.1,18.9 57.4,18.9 57.9,18.4 57.9,17.5 58.6,16.8 59.8,16.8 60.5,17.5 60.5,20.9 62.5,22.9 63.5,22.9 64,22.4 64,20.9 P2.4
SWDIO  (via drill 0.3)
  Top 0.2: v58.3,13.6 58.3,14.7 58.2,14.8 58.2,15.8 58.8,16.4 59.8,16.4 60,16.2 v61.6,16.2
  Bottom 0.2: U1.39 43.57,11.43 44,11 49.4,11 49.5,10.9 50.6,10.9 51.8,9.7 55.4,9.7 55.9,9.2 57.4,9.2 58.1,9.9 58.1,13.4 v58.3,13.6 | P2.2 63.3,16.2 v61.6,16.2
TXD  (via drill 0.3)
  Top 0.2: v47.6,13.8 v49.6,15.8
  Bottom 0.2: v47.6,13.8 47.2,14.2 U1.36 | v49.6,15.8 49.6,15.6 50.4,14.8 55.2,14.8 55.7,14.3 57.2,14.3 58.22,15.32 P1.17

### Text on the board
Top: www.selfbus.org
Bottom: BOT | 1
tPlace: LPC1115_4TE_TOP V1.1
bNames: 1 | LPC1115_4TE_TOP V1.1
_bsilk: 2 | 1